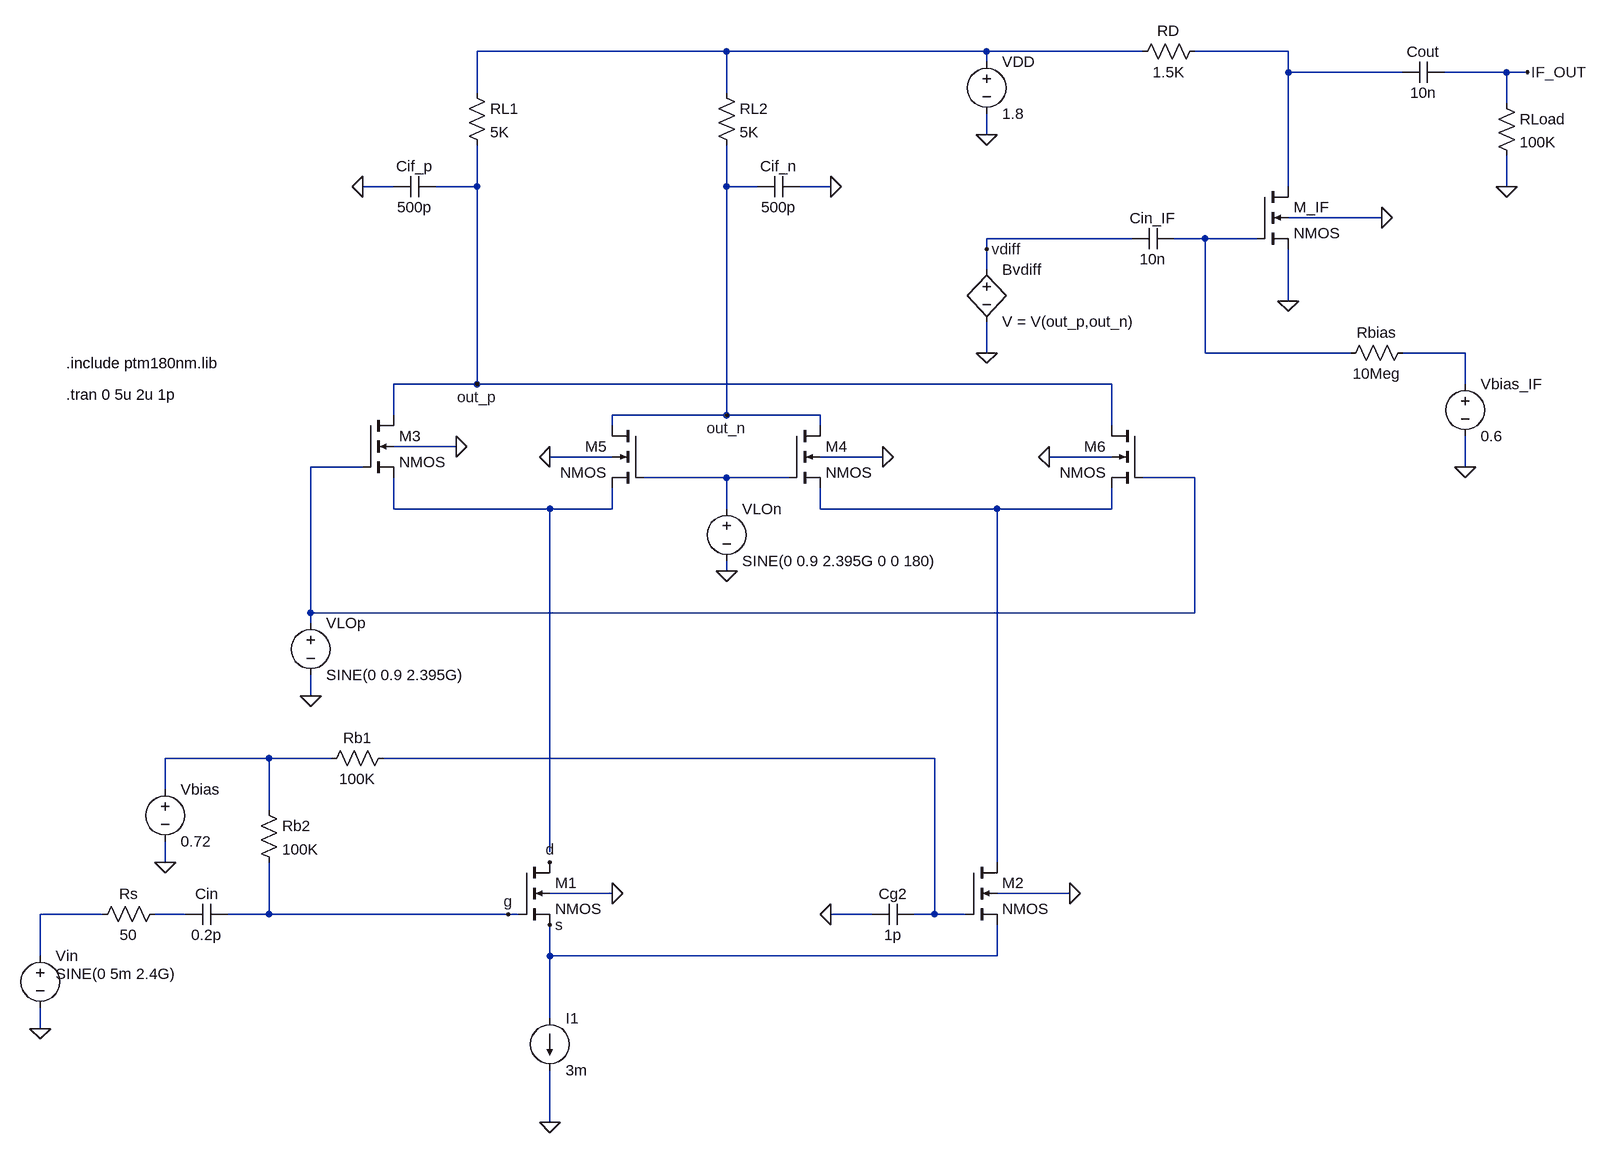
[diagram p0: schematic Gilbert_Mixer_With_IF_Amplifier.asc]
Gilbert_Mixer_With_IF_Amplifier.asc, the LTspice schematic file:
Version 4
SHEET 1 1192 680
WIRE -240 -3696 -624 -3696
WIRE 160 -3696 -240 -3696
WIRE 400 -3696 160 -3696
WIRE 624 -3696 480 -3696
WIRE 160 -3680 160 -3696
WIRE 624 -3664 624 -3696
WIRE 800 -3664 624 -3664
WIRE 960 -3664 864 -3664
WIRE 992 -3664 960 -3664
WIRE -624 -3632 -624 -3696
WIRE -240 -3632 -240 -3696
WIRE 960 -3616 960 -3664
WIRE 160 -3568 160 -3600
WIRE -752 -3488 -800 -3488
WIRE -624 -3488 -624 -3552
WIRE -624 -3488 -688 -3488
WIRE -240 -3488 -240 -3552
WIRE -192 -3488 -240 -3488
WIRE -80 -3488 -128 -3488
WIRE 624 -3488 624 -3664
WIRE 960 -3488 960 -3536
WIRE 768 -3440 624 -3440
WIRE 384 -3408 160 -3408
WIRE 496 -3408 448 -3408
WIRE 576 -3408 496 -3408
WIRE 160 -3392 160 -3408
WIRE 160 -3360 160 -3392
WIRE 624 -3312 624 -3392
WIRE 160 -3232 160 -3280
WIRE 496 -3232 496 -3408
WIRE 720 -3232 496 -3232
WIRE 896 -3232 800 -3232
WIRE -624 -3184 -624 -3488
WIRE -624 -3184 -752 -3184
WIRE 352 -3184 -624 -3184
WIRE 896 -3184 896 -3232
WIRE -752 -3136 -752 -3184
WIRE -240 -3136 -240 -3488
WIRE -240 -3136 -416 -3136
WIRE -96 -3136 -240 -3136
WIRE -416 -3120 -416 -3136
WIRE -96 -3120 -96 -3136
WIRE 352 -3120 352 -3184
WIRE -656 -3088 -752 -3088
WIRE -416 -3072 -512 -3072
WIRE 0 -3072 -96 -3072
WIRE 352 -3072 256 -3072
WIRE -800 -3056 -880 -3056
WIRE 896 -3056 896 -3104
WIRE -240 -3040 -368 -3040
WIRE -144 -3040 -240 -3040
WIRE 480 -3040 400 -3040
WIRE -752 -2992 -752 -3040
WIRE -512 -2992 -752 -2992
WIRE -416 -2992 -416 -3024
WIRE -416 -2992 -512 -2992
WIRE -240 -2992 -240 -3040
WIRE -96 -2992 -96 -3024
WIRE 176 -2992 -96 -2992
WIRE 352 -2992 352 -3024
WIRE 352 -2992 176 -2992
WIRE -240 -2896 -240 -2912
WIRE -880 -2832 -880 -3056
WIRE 480 -2832 480 -3040
WIRE 480 -2832 -880 -2832
WIRE -880 -2816 -880 -2832
WIRE -880 -2704 -880 -2736
WIRE -944 -2608 -1104 -2608
WIRE -848 -2608 -944 -2608
WIRE 80 -2608 -768 -2608
WIRE -1104 -2560 -1104 -2608
WIRE -944 -2528 -944 -2608
WIRE -512 -2464 -512 -2992
WIRE -1104 -2448 -1104 -2480
WIRE 176 -2448 176 -2992
WIRE -416 -2400 -512 -2400
WIRE 288 -2400 176 -2400
WIRE -1200 -2368 -1296 -2368
WIRE -1072 -2368 -1120 -2368
WIRE -944 -2368 -944 -2448
WIRE -944 -2368 -1008 -2368
WIRE -576 -2368 -944 -2368
WIRE -560 -2368 -576 -2368
WIRE -16 -2368 -80 -2368
WIRE 80 -2368 80 -2608
WIRE 80 -2368 48 -2368
WIRE 128 -2368 80 -2368
WIRE -1296 -2304 -1296 -2368
WIRE -512 -2304 -512 -2352
WIRE 176 -2304 176 -2352
WIRE 176 -2304 -512 -2304
WIRE -512 -2208 -512 -2304
WIRE -1296 -2192 -1296 -2224
WIRE -512 -2048 -512 -2128
FLAG -512 -2048 0
FLAG 160 -3568 0
FLAG -1296 -2192 0
FLAG -416 -2400 0
FLAG -576 -2368 g
FLAG -512 -2448 d
FLAG -512 -2352 s
FLAG -1104 -2448 0
FLAG -80 -2368 0
FLAG -656 -3088 0
FLAG -512 -3072 0
FLAG 0 -3072 0
FLAG 256 -3072 0
FLAG -240 -2896 0
FLAG -880 -2704 0
FLAG -624 -3184 out_p
FLAG -240 -3136 out_n
FLAG 288 -2400 0
FLAG -800 -3488 0
FLAG -80 -3488 0
FLAG 160 -3232 0
FLAG 160 -3392 vdiff
FLAG 624 -3312 0
FLAG 992 -3664 IF_OUT
FLAG 896 -3056 0
FLAG 768 -3440 0
FLAG 960 -3488 0
SYMBOL voltage 160 -3696 R0
WINDOW 123 0 0 Left 0
WINDOW 39 0 0 Left 0
SYMATTR InstName VDD
SYMATTR Value 1.8
SYMBOL voltage -1296 -2320 R0
WINDOW 3 24 44 Left 2
WINDOW 123 0 0 Left 0
WINDOW 39 0 0 Left 0
SYMATTR Value SINE(0 5m 2.4G)
SYMATTR InstName Vin
SYMBOL nmos4 -560 -2448 R0
SYMATTR InstName M1
SYMATTR Value2 l=180n w=600u
SYMBOL cap -1008 -2384 R90
WINDOW 0 0 32 VBottom 2
WINDOW 3 32 32 VTop 2
SYMATTR InstName Cin
SYMATTR Value 0.2p
SYMBOL voltage -1104 -2576 R0
WINDOW 123 0 0 Left 0
WINDOW 39 0 0 Left 0
SYMATTR InstName Vbias
SYMATTR Value 0.72
SYMBOL res -1104 -2384 R90
WINDOW 0 0 56 VBottom 2
WINDOW 3 32 56 VTop 2
SYMATTR InstName Rs
SYMATTR Value 50
SYMBOL res -752 -2624 R90
WINDOW 0 0 56 VBottom 2
WINDOW 3 32 56 VTop 2
SYMATTR InstName Rb1
SYMATTR Value 100K
SYMBOL nmos4 128 -2448 R0
SYMATTR InstName M2
SYMATTR Value2 l=180n w=600u
SYMBOL res -960 -2544 R0
SYMATTR InstName Rb2
SYMATTR Value 100K
SYMBOL cap 48 -2384 R90
WINDOW 0 0 32 VBottom 2
WINDOW 3 32 32 VTop 2
SYMATTR InstName Cg2
SYMATTR Value 1p
SYMBOL current -512 -2208 R0
WINDOW 123 0 0 Left 0
WINDOW 39 0 0 Left 0
SYMATTR InstName I1
SYMATTR Value 3m
SYMBOL res -640 -3648 R0
SYMATTR InstName RL1
SYMATTR Value 5K
SYMBOL res -256 -3648 R0
SYMATTR InstName RL2
SYMATTR Value 5K
SYMBOL nmos4 -800 -3136 R0
SYMATTR InstName M3
SYMATTR Value2 l=180n w=300u
SYMBOL nmos4 -368 -3120 M0
SYMATTR InstName M5
SYMATTR Value2 l=180n w=300u
SYMBOL nmos4 -144 -3120 R0
SYMATTR InstName M4
SYMATTR Value2 l=180n w=300u
SYMBOL nmos4 400 -3120 M0
SYMATTR InstName M6
SYMATTR Value2 l=180n w=300u
SYMBOL voltage -240 -3008 R0
WINDOW 123 0 0 Left 0
WINDOW 39 0 0 Left 0
SYMATTR InstName VLOn
SYMATTR Value SINE(0 0.9 2.395G 0 0 180)
SYMBOL voltage -880 -2832 R0
WINDOW 123 0 0 Left 0
WINDOW 39 0 0 Left 0
SYMATTR InstName VLOp
SYMATTR Value SINE(0 0.9 2.395G)
SYMBOL cap -688 -3504 R90
WINDOW 0 0 32 VBottom 2
WINDOW 3 32 32 VTop 2
SYMATTR InstName Cif_p
SYMATTR Value 500p
SYMBOL cap -128 -3504 R90
WINDOW 0 0 32 VBottom 2
WINDOW 3 32 32 VTop 2
SYMATTR InstName Cif_n
SYMATTR Value 500p
SYMBOL bv 160 -3376 R0
SYMATTR InstName Bvdiff
SYMATTR Value V = V(out_p,out_n)
SYMBOL nmos4 576 -3488 R0
SYMATTR InstName M_IF
SYMATTR Value2 l=180n w=120u
SYMBOL res 496 -3712 R90
WINDOW 0 0 56 VBottom 2
WINDOW 3 32 56 VTop 2
SYMATTR InstName RD
SYMATTR Value 1.5K
SYMBOL cap 864 -3680 R90
WINDOW 0 0 32 VBottom 2
WINDOW 3 32 32 VTop 2
SYMATTR InstName Cout
SYMATTR Value 10n
SYMBOL cap 448 -3424 R90
WINDOW 0 0 32 VBottom 2
WINDOW 3 32 32 VTop 2
SYMATTR InstName Cin_IF
SYMATTR Value 10n
SYMBOL res 816 -3248 R90
WINDOW 0 0 56 VBottom 2
WINDOW 3 32 56 VTop 2
SYMATTR InstName Rbias
SYMATTR Value 10Meg
SYMBOL voltage 896 -3200 R0
WINDOW 123 0 0 Left 0
WINDOW 39 0 0 Left 0
SYMATTR InstName Vbias_IF
SYMATTR Value 0.6
SYMBOL res 944 -3632 R0
SYMATTR InstName RLoad
SYMATTR Value 100K
TEXT -1256 -3216 Left 2 !.include ptm180nm.lib
TEXT -1256 -3168 Left 2 !.tran 0 5u 2u 1p

The netlist it stands for:
* Gilbert_Mixer_With_IF_Amplifier.asc
VDD N001 0 1.8
Vin N011 0 SINE(0 5m 2.4G)
M1 d g s 0 NMOS l=180n w=600u
Cin g N012 0.2p
Vbias N009 0 0.72
Rs N012 N011 50
Rb1 N010 N009 100K
M2 N008 N010 s 0 NMOS l=180n w=600u
Rb2 N009 g 100K
Cg2 N010 0 1p
I1 s 0 3m
RL1 N001 out_p 5K
RL2 N001 out_n 5K
M3 out_p N005 N007 0 NMOS l=180n w=300u
M5 out_n N006 N007 0 NMOS l=180n w=300u
M4 out_n N006 N008 0 NMOS l=180n w=300u
M6 out_p N005 N008 0 NMOS l=180n w=300u
VLOn N006 0 SINE(0 0.9 2.395G 0 0 180)
VLOp N005 0 SINE(0 0.9 2.395G)
Cif_p out_p 0 500p
Cif_n 0 out_n 500p
Bvdiff vdiff 0 V = V(out_p,out_n)
M_IF N002 N003 0 0 NMOS l=180n w=120u
RD N002 N001 1.5K
Cout IF_OUT N002 10n
Cin_IF N003 vdiff 10n
Rbias N004 N003 10Meg
Vbias_IF N004 0 0.6
RLoad IF_OUT 0 100K
.model NMOS NMOS
.model PMOS PMOS
.lib standard.mos
.include ptm180nm.lib
.tran 0 5u 2u 1p
.backanno
.end